# EasyEDA Pro project ProPrj_TC375_2025-11-27.epro, board PCB1
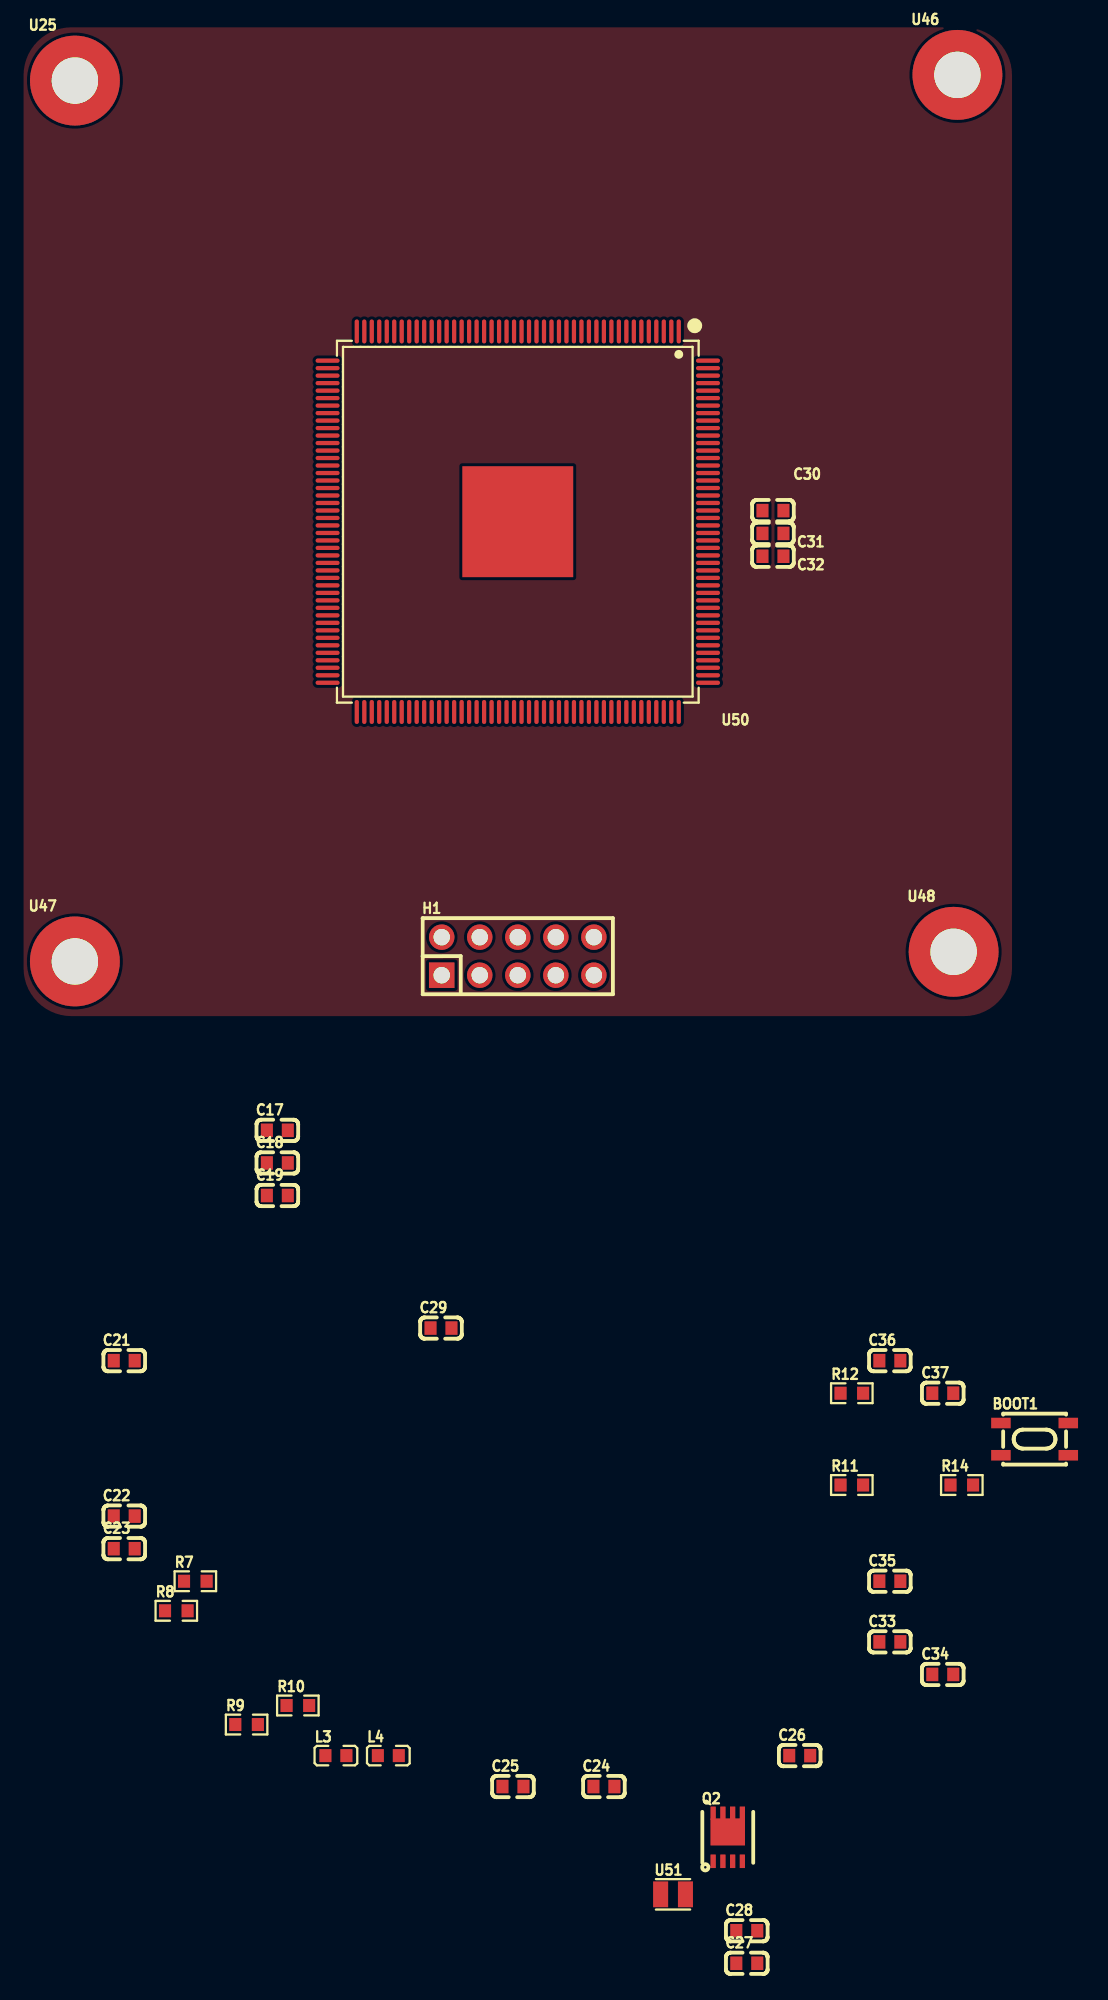
[diagram p2: board, top side]
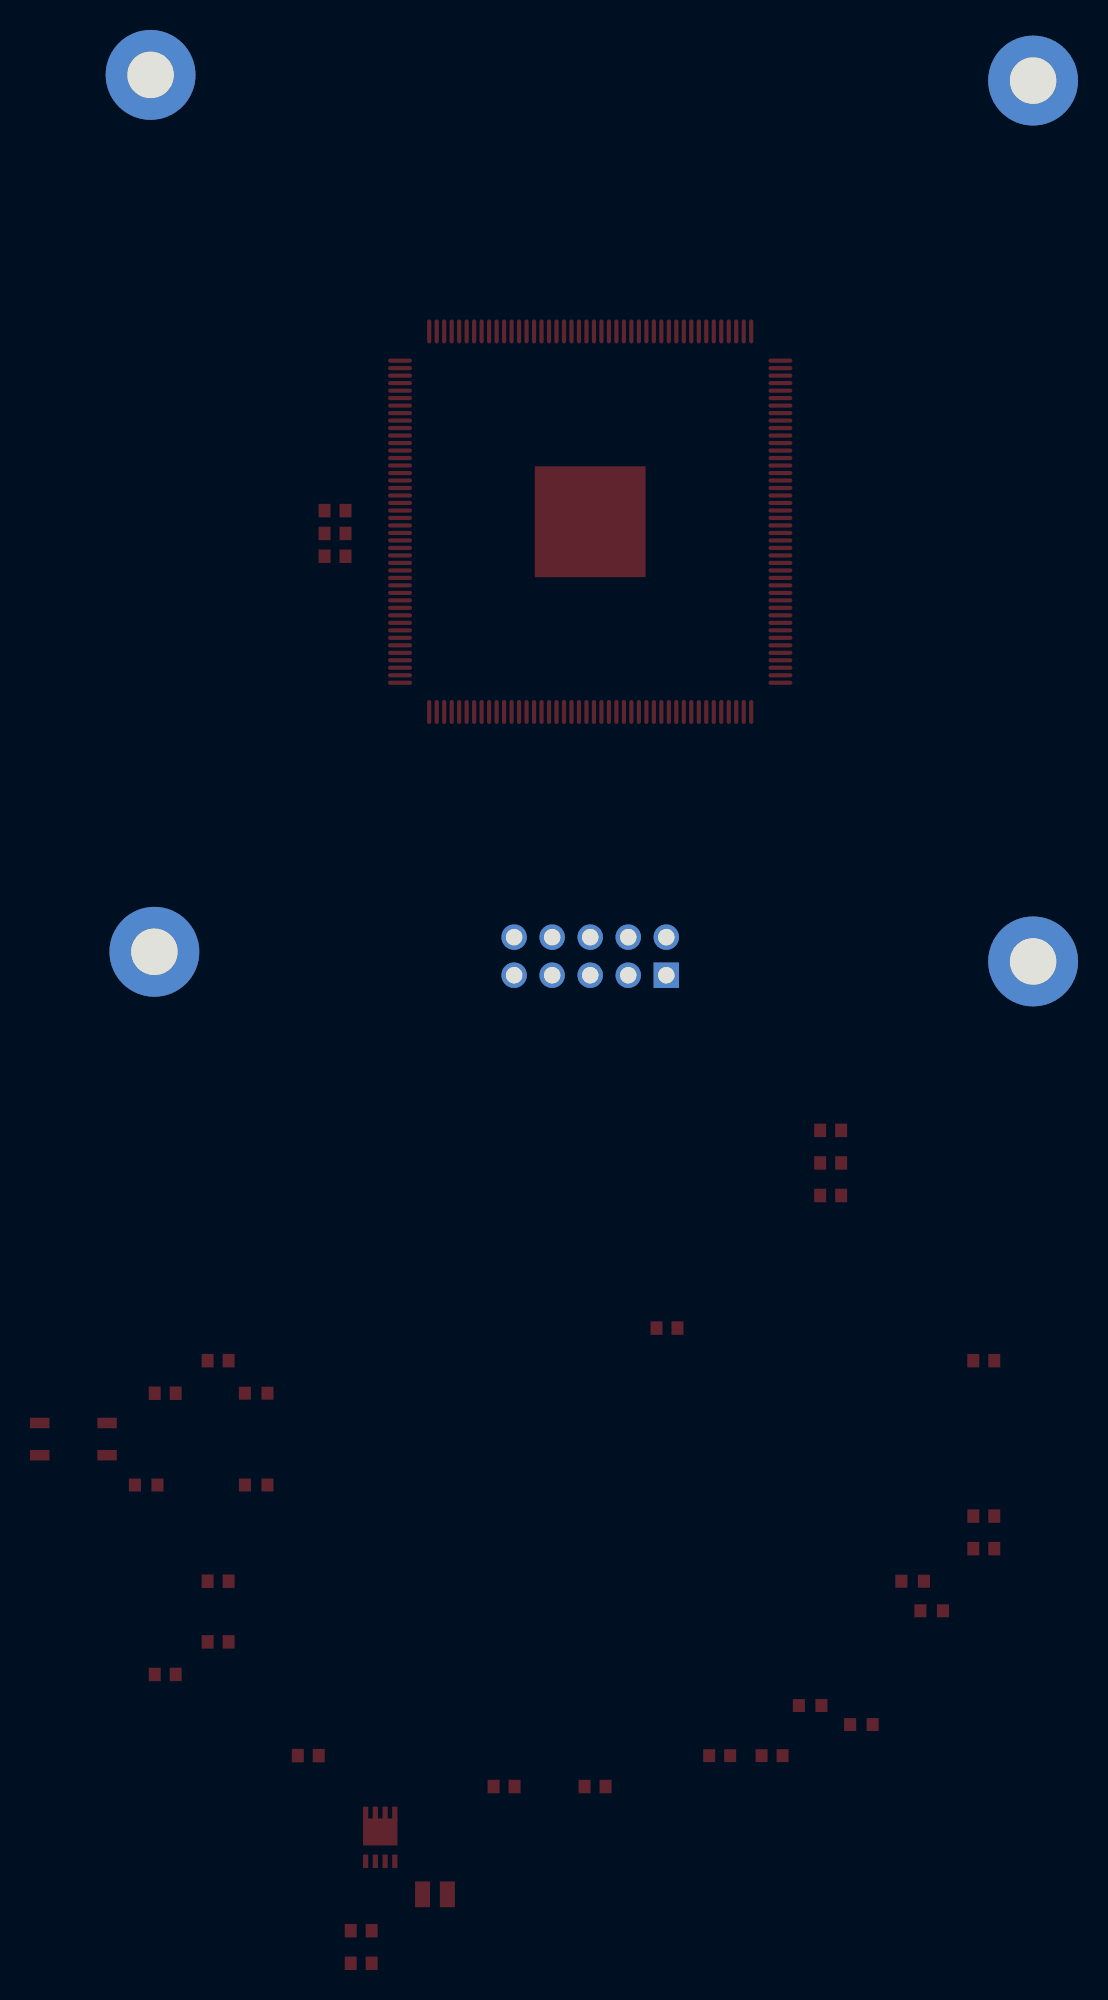
[diagram p3: board, bottom side, seen from below]

No outline. copper layers: Top Layer, Bottom Layer. Coordinates in mm from the lowest, leftmost part position.
Stack: Top Layer 0.012mm / Dielectric1 0.025mm FR4 er 4.5 / Bottom Layer 0.012mm

## Design rules (mm)
template: JLCPCB Capability(Two Layers Board)
spacing copperThickness1oz (default): track to track 0.102, other pairs 0.152 to 0.3
spacing copperThickness2oz: track to track 0.203, other pairs 0.152 to 0.3
track width copperThickness1oz (default): min 0.127, default 0.254, max 2.54
track width copperThickness2oz: min 0.203, default 0.254, max 2.54
differential pair differentialPair (default): width min 0.127, default 0.254, max 2.54; gap min 0.152, default 0.152
via viaSize (default): diameter min 0.5, default 0.61, max 10; hole min 0.3, default 0.305, max 6.3

## Placement (name value [footprint] x y rotation side)
BOOT1  3*4*2.5mm 贴片4脚  [SW-SMD_4P-L4.2-W3.3-P2.15-LS5.1]  64.08 34.99 0 top
C17  100nF  [C0603]  13.52 55.6 0 top
C18  100nF  [C0603]  13.52 53.42 0 top
C19  100nF  [C0603]  13.52 51.25 0 top
C21  100nF  [C0603]  3.29 40.22 0 top
C22  100nF  [C0603]  3.29 29.85 0 top
C23  100nF  [C0603]  3.29 27.67 0 top
C24  100nF  [C0603]  35.32 11.8 0 top
C25  100nF  [C0603]  29.25 11.8 0 top
C26  22uF  [C0603]  48.4 13.86 0 top
C27  10uF  [C0603]  44.86 0 0 top
C28  22uF  [C0603]  44.86 2.17 0 top
C29  100nF  [C0603]  24.45 42.4 0 top
C30  100nF  [C0603]  46.61 96.96 180 top
C31  100nF  [C0603]  46.61 95.44 180 top
C32  100nF  [C0603]  46.61 93.92 180 top
C33  100nF  [C0603]  54.42 21.45 0 top
C34  100nF  [C0603]  57.95 19.28 0 top
C35  100nF  [C0603]  54.42 25.5 0 top
C36  100nF  [C0603]  54.42 40.22 0 top
C37  100nF  [C0603]  57.95 38.05 0 top
H1  PZ254V-12-10P  [HDR-TH_10P-P2.54-V-M-R2-C5-S2.54]  29.57 67.22 0 top
L3  0R  [L0603]  17.43 13.86 0 top
L4  0R  [L0603]  20.93 13.86 0 top
Q2  BSZ15DC02KD H  [PG-TSDSON-8_L3.3-W3.3-P0.65-BL]  43.59 8.41 0 top
R7  0R  [R0603]  8.04 25.5 0 top
R8  0R  [R0603]  6.77 23.53 0 top
R9  0R  [R0603]  11.47 15.94 0 top
R10  0R  [R0603]  14.89 17.21 0 top
R11  10K  [R0603]  51.88 31.92 0 top
R12  680R  [R0603]  51.88 38.05 0 top
R14  10K  [R0603]  59.22 31.92 0 top
U25  M3安装孔  [洞3MM]  0 125.67 0 top
U46  M3安装孔  [洞3MM]  58.93 126.04 0 top
U47  M3安装孔  [洞3MM]  0 66.87 0 top
U48  M3安装孔  [洞3MM]  58.67 67.51 0 top
U50  -  [LQFP-176_L24.0-W24.0-P0.50-LS26.0-BL-EP7.4]  29.57 96.22 180 top
U51  3.3uH  [IND-SMD_L2.0-W1.6]  39.94 4.6 0 top

## Footprints (pads in the part's own frame, mm; a bottom-side part is the same pattern mirrored in y, then rotated)
C0603
  rect 0.8x0.9 smd: 1(-0.7,0) 2(0.7,0)
HDR-TH_10P-P2.54-V-M-R2-C5-S2.54
  rect 1.7x1.7 hole 1.1: 1(-5.08,-1.27)
  round 1.7 hole 1.1: 2(-5.08,1.27) 3(-2.54,-1.27) 4(-2.54,1.27) 5(0,-1.27) 6(0,1.27) 7(2.54,-1.27) 8(2.54,1.27) 9(5.08,-1.27) 10(5.08,1.27)
IND-SMD_L2.0-W1.6
  rect 1x1.72 smd: 1(0.828,0) 2(-0.828,0)
L0603
  rect 0.8x0.864 smd: 1(-0.7,0) 2(0.7,0)
LQFP-176_L24.0-W24.0-P0.50-LS26.0-BL-EP7.4
  oval 0.28x1.6 smd: 1(-10.75,-12.7) 2(-10.25,-12.7) 3(-9.75,-12.7) 4(-9.25,-12.7) 5(-8.75,-12.7) 6(-8.25,-12.7) 7(-7.75,-12.7) 8(-7.25,-12.7) 9(-6.75,-12.7) 10(-6.25,-12.7) 11(-5.75,-12.7) 12(-5.25,-12.7) 13(-4.75,-12.7) 14(-4.25,-12.7) 15(-3.75,-12.7) 16(-3.25,-12.7) 17(-2.75,-12.7) 18(-2.25,-12.7) 19(-1.75,-12.7) 20(-1.25,-12.7) 21(-0.75,-12.7) 22(-0.25,-12.7) 23(0.25,-12.7) 24(0.75,-12.7) 25(1.25,-12.7) 26(1.75,-12.7) 27(2.25,-12.7) 28(2.75,-12.7) 29(3.25,-12.7) 30(3.75,-12.7) 31(4.25,-12.7) 32(4.75,-12.7) 33(5.25,-12.7) 34(5.75,-12.7) 35(6.25,-12.7) 36(6.75,-12.7) 37(7.25,-12.7) 38(7.75,-12.7) 39(8.25,-12.7) 40(8.75,-12.7) 41(9.25,-12.7) 42(9.75,-12.7) 43(10.25,-12.7) 44(10.75,-12.7) 89(10.75,12.7) 90(10.25,12.7) 91(9.75,12.7) 92(9.25,12.7) 93(8.75,12.7) 94(8.25,12.7) 95(7.75,12.7) 96(7.25,12.7) 97(6.75,12.7) 98(6.25,12.7) 99(5.75,12.7) 100(5.25,12.7) 101(4.75,12.7) 102(4.25,12.7) 103(3.75,12.7) 104(3.25,12.7) 105(2.75,12.7) 106(2.25,12.7) 107(1.75,12.7) 108(1.25,12.7) 109(0.75,12.7) 110(0.25,12.7) 111(-0.25,12.7) 112(-0.75,12.7) 113(-1.25,12.7) 114(-1.75,12.7) 115(-2.25,12.7) 116(-2.75,12.7) 117(-3.25,12.7) 118(-3.75,12.7) 119(-4.25,12.7) 120(-4.75,12.7) 121(-5.25,12.7) 122(-5.75,12.7) 123(-6.25,12.7) 124(-6.75,12.7) 125(-7.25,12.7) 126(-7.75,12.7) 127(-8.25,12.7) 128(-8.75,12.7) 129(-9.25,12.7) 130(-9.75,12.7) 131(-10.25,12.7) 132(-10.75,12.7)
  oval 1.6x0.28 smd: 45(12.7,-10.75) 46(12.7,-10.25) 47(12.7,-9.75) 48(12.7,-9.25) 49(12.7,-8.75) 50(12.7,-8.25) 51(12.7,-7.75) 52(12.7,-7.25) 53(12.7,-6.75) 54(12.7,-6.25) 55(12.7,-5.75) 56(12.7,-5.25) 57(12.7,-4.75) 58(12.7,-4.25) 59(12.7,-3.75) 60(12.7,-3.25) 61(12.7,-2.75) 62(12.7,-2.25) 63(12.7,-1.75) 64(12.7,-1.25) 65(12.7,-0.75) 66(12.7,-0.25) 67(12.7,0.25) 68(12.7,0.75) 69(12.7,1.25) 70(12.7,1.75) 71(12.7,2.25) 72(12.7,2.75) 73(12.7,3.25) 74(12.7,3.75) 75(12.7,4.25) 76(12.7,4.75) 77(12.7,5.25) 78(12.7,5.75) 79(12.7,6.25) 80(12.7,6.75) 81(12.7,7.25) 82(12.7,7.75) 83(12.7,8.25) 84(12.7,8.75) 85(12.7,9.25) 86(12.7,9.75) 87(12.7,10.25) 88(12.7,10.75) 133(-12.7,10.75) 134(-12.7,10.25) 135(-12.7,9.75) 136(-12.7,9.25) 137(-12.7,8.75) 138(-12.7,8.25) 139(-12.7,7.75) 140(-12.7,7.25) 141(-12.7,6.75) 142(-12.7,6.25) 143(-12.7,5.75) 144(-12.7,5.25) 145(-12.7,4.75) 146(-12.7,4.25) 147(-12.7,3.75) 148(-12.7,3.25) 149(-12.7,2.75) 150(-12.7,2.25) 151(-12.7,1.75) 152(-12.7,1.25) 153(-12.7,0.75) 154(-12.7,0.25) 155(-12.7,-0.25) 156(-12.7,-0.75) 157(-12.7,-1.25) 158(-12.7,-1.75) 159(-12.7,-2.25) 160(-12.7,-2.75) 161(-12.7,-3.25) 162(-12.7,-3.75) 163(-12.7,-4.25) 164(-12.7,-4.75) 165(-12.7,-5.25) 166(-12.7,-5.75) 167(-12.7,-6.25) 168(-12.7,-6.75) 169(-12.7,-7.25) 170(-12.7,-7.75) 171(-12.7,-8.25) 172(-12.7,-8.75) 173(-12.7,-9.25) 174(-12.7,-9.75) 175(-12.7,-10.25) 176(-12.7,-10.75)
  rect 7.4x7.4 smd: 177(0,0)
PG-TSDSON-8_L3.3-W3.3-P0.65-BL
  rect 0.35x0.9 smd: 1(-0.975,-1.6) 2(-0.325,-1.6) 3(0.325,-1.6) 4(0.975,-1.6) 5(0.975,1.6) 6(0.325,1.6) 7(-0.325,1.6) 8(-0.975,1.6)
  rect 2.3x1.8 smd: 9(0,0.36)
R0603
  rect 0.806x0.864 smd: 1(-0.753,0) 2(0.753,0)
SW-SMD_4P-L4.2-W3.3-P2.15-LS5.1
  rect 1.3x0.7 smd: 1(-2.25,1.075) 2(2.25,1.075) 3(-2.25,-1.075) 4(2.25,-1.075)
洞3MM
  round 6 hole 3.1: 1(0,0)

## Nets
As in the schematic.

Pads without a net: H1 7 9; U25 1; U46 1; U47 1; U48 1; U50 1 2 3 4 5 6 7 8 9 11 12 13 14 15 16 17 18 19 20 21 22 23 28 29 30 31 32 33 34 35 36 37 38 39 40 41 42 43 44 45 46 47 48 49 50 55 56 57 58 59 60 61 62 63 64 65 66 67 70 71 72 73 74 75 76 77 78 79 80 81 82 83 86 87 88 89 90 91 92 93 94 95 96 97 98 102 103 105 106 107 108 109 110 111 116 117 118 119 124 125 126 127 128 129 130 131 132 133 134 135 136 137 138 139 140 141 142 143 144 145 146 147 148 149 150 151 152 156 157 158 159 160 161 162 163 165 166 167 168 169 170 171 172 173 174 175 176 177

## Copper pours and planes (outline as drawn; the poured copper is in the pictures)
(no net) on Top Layer: -3.43,126.02 -3.41,126.38 -3.35,126.73 -3.25,127.08 -3.11,127.41 -2.94,127.72 -2.73,128.02 -2.49,128.28 -2.22,128.52 -1.93,128.73 -1.61,128.9 -1.28,129.04 -0.94,129.14 -0.58,129.2 -0.23,129.22 59.37,129.22 59.73,129.2 60.09,129.14 60.43,129.04 60.76,128.9 61.08,128.73 61.37,128.52 61.64,128.28 61.88,128.02 62.08,127.72 62.26,127.41 62.39,127.08 62.49,126.73 62.55,126.38 62.57,126.02 62.57,66.42 62.55,66.06 62.49,65.71 62.39,65.36 62.26,65.03 62.08,64.72 61.88,64.43 61.64,64.16 61.37,63.92 61.08,63.71 60.76,63.54 60.43,63.4 60.09,63.3 59.73,63.24 59.37,63.22 -0.23,63.22 -0.58,63.24 -0.94,63.3 -1.28,63.4 -1.61,63.54 -1.93,63.71 -2.22,63.92 -2.49,64.16 -2.73,64.43 -2.94,64.72 -3.11,65.03 -3.25,65.36 -3.35,65.71 -3.41,66.06 -3.43,66.42
